# Altium schematic sheet Accumulator_Voltage_Indicator.SchDoc
size A4
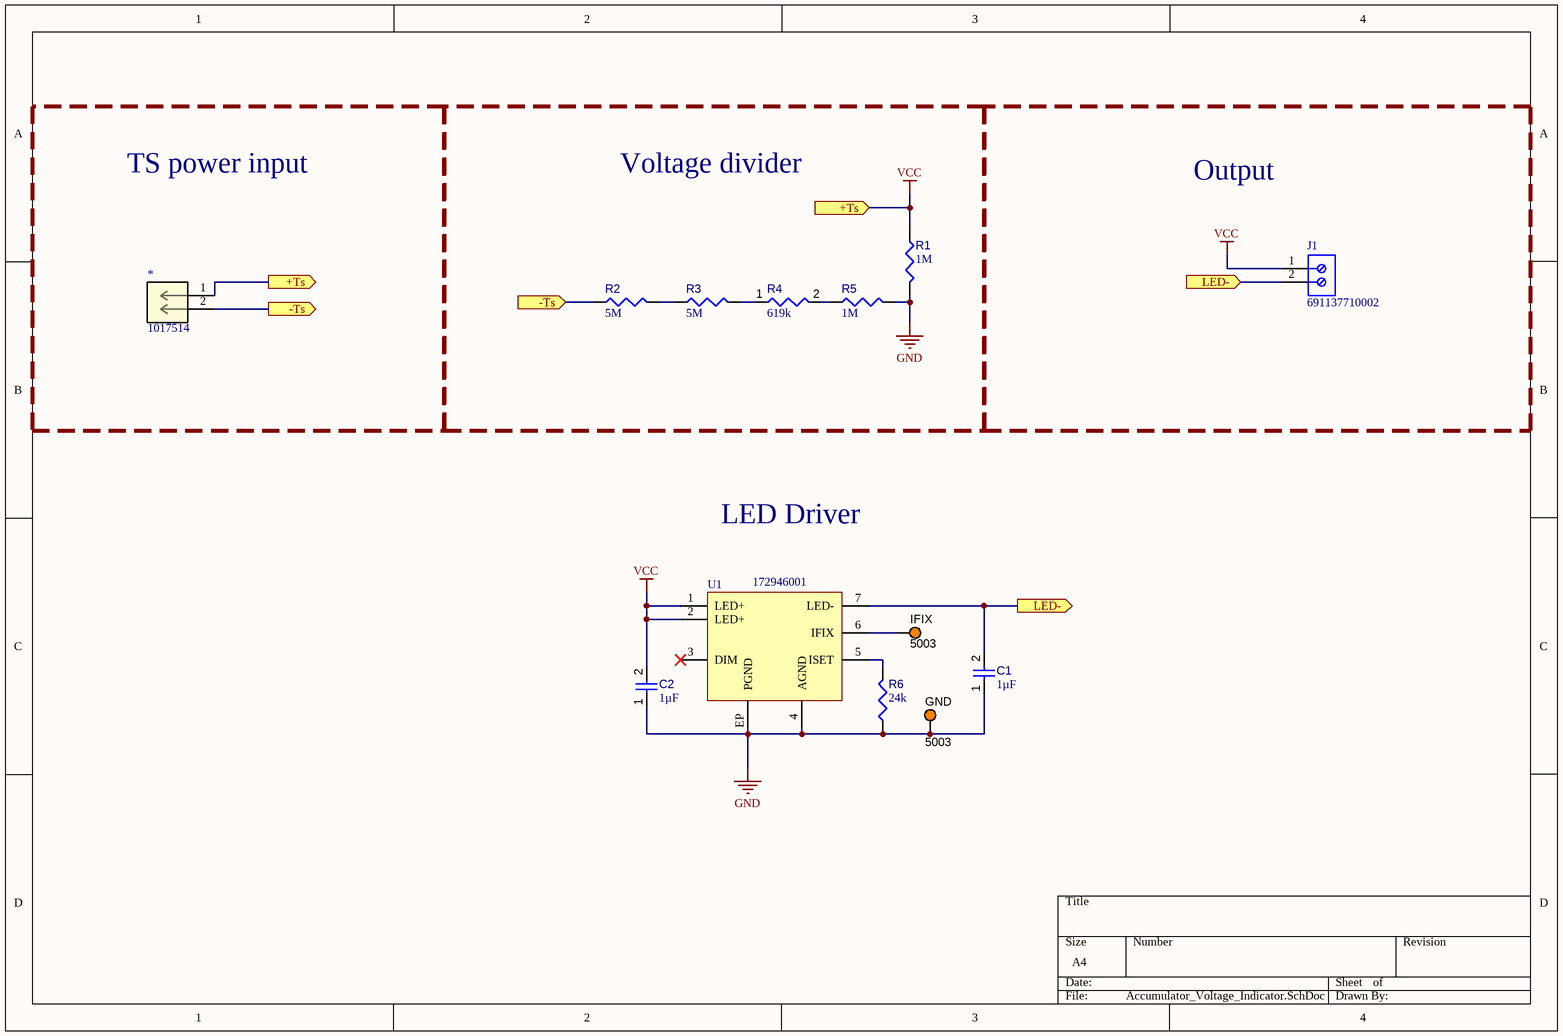
[diagram p0: Accumulator_Voltage_Indicator.SchDoc]

## Parts
*  1017514  [CONN_1017514]
C1  value 1µF  [CAPC0603(1608)100_L]  (hidden comment: Capacitor 1µF +/-0.1% 25V 0603)
C2  value 1µF  [CAPC0603(1608)100_L]  (hidden comment: Capacitor 1µF +/-0.1% 25V 0603)
GND  5003  [KSTN-5003]
IFIX  5003  [KSTN-5003]
J1  691137710002  [691137710002]
R1  value 1M  [RESC5025X65N]  (hidden comment: RMCF2010FT1M00)
R2  value 5M  [RES_2512_OHM-L]  (hidden comment: HVC2512T5004JET)
R3  value 5M  [RES_2512_OHM-L]  (hidden comment: HVC2512T5004JET)
R4  value 619k  [RESC5025X65N]  (hidden comment: RC2010FK-07619KL)
R5  value 1M  [RESC5025X65N]  (hidden comment: RMCF2010FT1M00)
R6  value 24k  [RESC0603(1608)_L]  (hidden comment: RC0603JR-0724KL)
U1  172946001  [WPME-LDHM_TO263-7EP_L13.77W10.16H4.57]

## Blocks framed on the sheet
TS power input: *
Voltage divider: R1-R5
Output: J1

## Ports
+Ts (in), +Ts (out), -Ts (in), -Ts (out), LED- (in), LED- (out)

## Nets
GND: C1.1 C2.1 GND.1 R1.2 R5.2 R6.1 U1.4(AGND) U1.EP(PGND)
VCC: *.1 C2.2 J1.1 R1.1 U1.1(LED+) U1.2(LED+) ; port +Ts
-Ts: *.2 R2.1 ; port -Ts
LED-: C1.2 J1.2 U1.7(LED-) ; port LED-
NetIFIX_1: IFIX.1 U1.6(IFIX)
NetR2_2: R2.2 R3.1
NetR3_2: R3.2 R4.1
NetR4_2: R4.2 R5.1
NetR6_2: R6.2 U1.5(ISET)

Not connected (* = marked no-connect by the designer): U1 3(DIM)*

## Notes on the sheet
- LED Driver

## Library data of the parts
* = CMP-002-00077-5: Barrier Strip Terminal Block; RoHS Compliant: Yes
C1 C2 = CMP-001-00055-4: Chip Capacitor, 1µF +/-0.1%, 25V, 0603, Thickness 1 mm; Tolerance: 20%; Min Operating Temperature: -55°C; Max Operating Temperature: 85°C; Voltage Rating: 25V; Mounting Technology: SMT; Case/Package: 0603; Pins: 2
GND IFIX = CMP-002-00037-2: Test Point, Orange, Height 4.6 mm, Tail Length 3 mm, 1-Pin THD, RoHS; Manufacturer: Keystone; Colour: Orange; Packaging: Bulk; Package Description: 1-Pin Through Hole Device, Dia 2.54 mm; Pins: 1; Package Reference: 5003; Datasheet Version: Jun-15; Case/Package: 5003; Mounting Technology: TH; Connector Type: TestPoint; Diameter: 2.54mm; Contact Material: Bronze; Datasheet URL: http://keyelco.com/userAssets/file/M65p56.pdf; Manufacturer URL: http://www.keyelco.com/; Package Quantity: 10; Contact Plating: Tin; RoHS Compliant: True
J1 = CMP-002-00084-1: Series 1377 - 5.00 mm Horizontal Entry with Pressure Clamp WR-TBL, 2 pin; RoHS Compliant: Yes
R1 R5 = CMP-009-00212-1: Fixed Resistor, Metal Glaze/thick Film, 0.75W, 1000000ohm, 200V, 1% +/-Tol, 100ppm/Cel, Surface Mount, 2010; Package Height: 0.55mm; Package Width: 2.5mm; Rated Temperature: 70°C; Reference Standard: AEC-Q200; Power: 750mW; Package Length: 5mm; Temperature Coefficient: 100ppm/°C; Working Voltage: 200V; Pins: 2; JESD-609 Code: e3; Packaging: Tape and Reel; Tolerance: 1%; Min Operating Temperature: -55°C; Terminal Finish: Nickel; Case/Package: 2010; Resistor Type: FIXED RESISTOR; Package Style: SMTMeter; RoHS Compliant: Yes; Technology: METAL GLAZE/THICK FILM; Construction: Rectangular; Max Operating Temperature: 155°C; Reach SVHC Compliant: Yes; Termination: Wraparound; Package Shape: Rectangular; Mounting Technology: Surface Mount
R2 R3 = CMP-009-00213-4: Fixed Resistor, Metal Glaze/thick Film, 1W, 5000000ohm, 2000V, 5% +/-Tol, 100ppm/Cel, Surface Mount, 2512; Package Width: 3.5mm; Working Voltage: 2kV; Additional Feature: PRECISION; Package Height: 0.6mm; Rated Temperature: 70°C; Package Length: 6.3mm; Temperature Coefficient: 100ppm/°C; Pins: 2; Reach SVHC Compliant: Yes; Case/Package: 2512; Termination: Wraparound; Power: 1W; Package Style: SMTMeter; Max Operating Temperature: 155°C; Tolerance: 5%; Package Shape: Rectangular; Resistor Type: FIXED RESISTOR; Min Operating Temperature: -55°C; Technology: METAL GLAZE/THICK FILM; Mounting Technology: Surface Mount; JESD-609 Code: e3; Packaging: Tape and Reel; Construction: Chip; Terminal Finish: Nickel; RoHS Compliant: Yes
R4 = CMP-009-00210-2: RES SMD 619K OHM 1% 3/4W 2010; Pins: 2; Design Item ID: RC2010FK-07619KL; Availability: Unavailable; MP: RC2010FK-07619KL; Price: None; Case/Package: 2010 (5025); Source: RC2010FK-07619KL.SchLib; Component Type: Standard
R6 = CMP-009-00184-4: Fixed Resistor, Metal Glaze/thick Film, 0.1W, 24000ohm, 75V, 5% +/-Tol, 100ppm/Cel, Surface Mount, 0603; Power: 100mW; RoHS Compliant: Yes; Mounting Technology: Surface Mount; Min Operating Temperature: -55°C; Tolerance: 5%; Max Operating Temperature: 155°C; Pins: 2; Case/Package: 0603
U1 = CMP-019-00055-1: LED Driver, 16-Segment; Min Supply Voltage: 4.5V; Max Supply Voltage: 60V; Multiplexed Display Capability: No; Channels: 1; Number of Segments: 16; Nominal Supply Voltage: 48V; Data Input Mode: SERIAL; fmax-Min: 920kHz; Interface IC Type: LED DISPLAY DRIVER; Height - Seated (Max): 4.82mm; Temperature Grade: INDUSTRIAL; Package Style: MICROELECTRONIC ASSEMBLYMeter; Surface Mount: Yes; Max Operating Temperature: 85°C; RoHS Compliant: Yes; Terminal Position: SINGLE; Terminal Pitch: 1.27mm; Min Operating Temperature: -40°C; Length: 10.16mm; Package Shape: Rectangular; Width: 9.85mm; Terminal Form: Gull Wing; Reach SVHC Compliant: Yes; Pins: 7